# EAGLE schematic Converter Board (EAGLE 8.3.1)
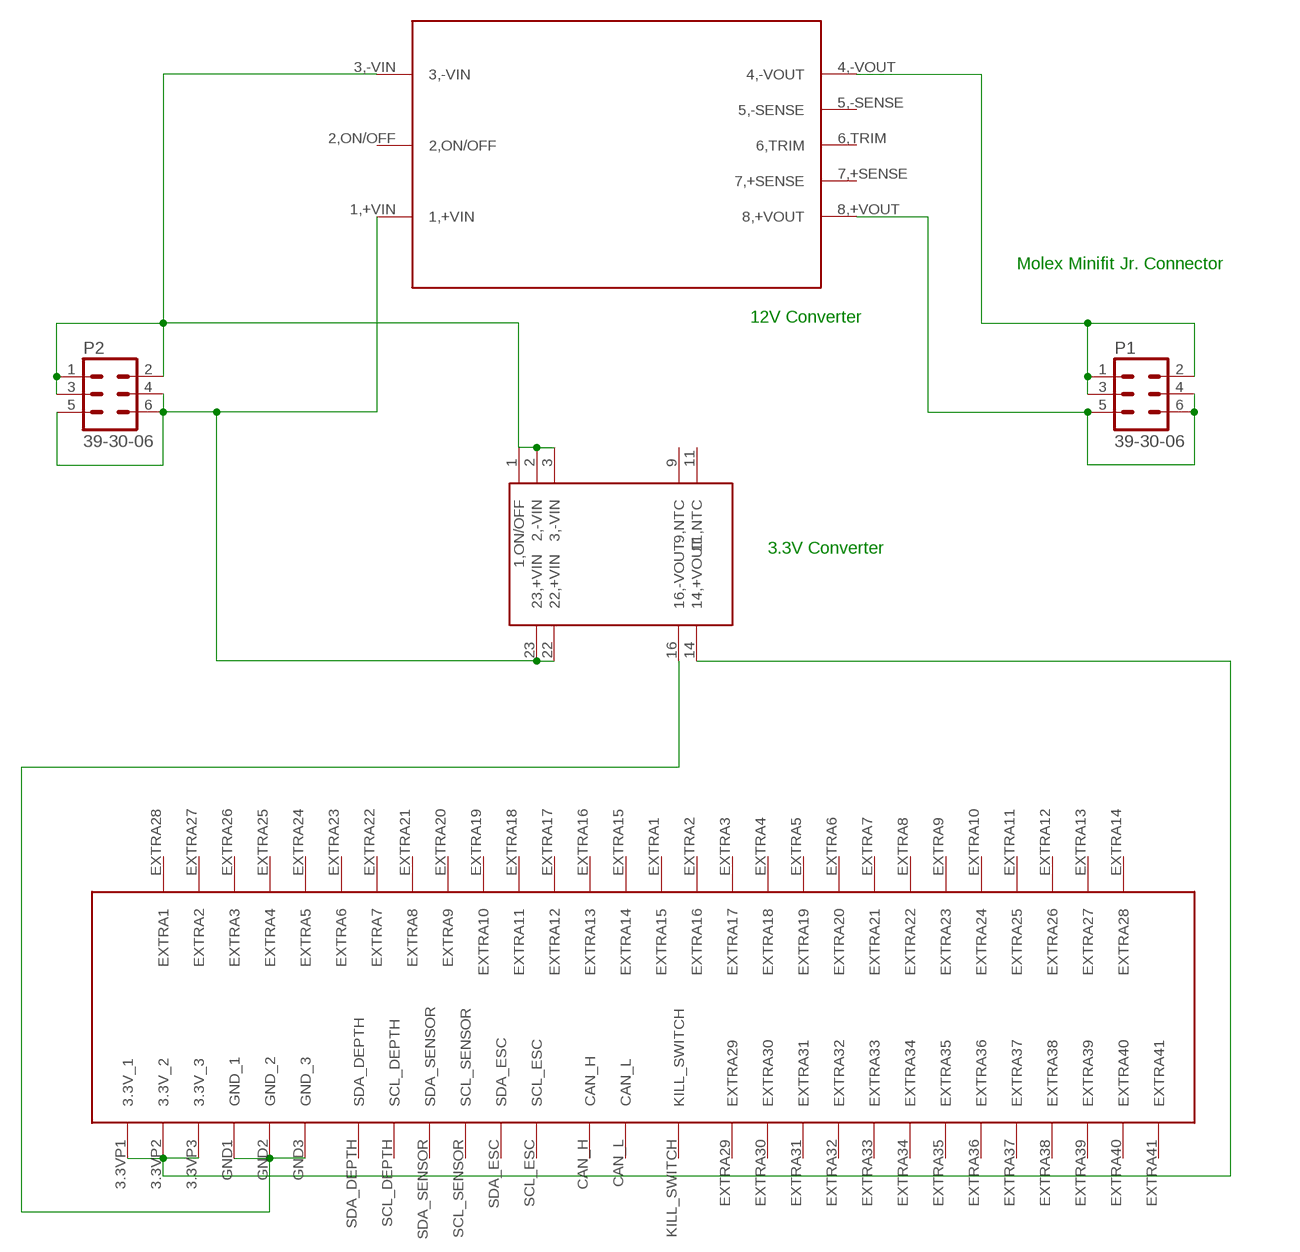
[diagram p0: schematic, sheet 1]

## Parts
P1  39-30-06  [39-30-?06?]
P2  39-30-06  [39-30-?06?]
U$1  3.3VCONV  [3.3VCONV]
U$2  12VCONV  [12VCONV]
U$3  5530843  [5530843-6-BOARDFINGERS]

## Nets
N$1: P2.4 P2.5 P2.6 U$1.22(22,+VIN) U$1.23(23,+VIN) U$2.1,+VIN
N$4: P2.1 P2.2 P2.3 U$1.2(2,-VIN) U$1.3(3,-VIN) U$2.3,-VIN
N$5: U$1.14(14,+VOUT) U$3.3.3VP1(3.3V_1) U$3.3.3VP2(3.3V_2) U$3.3.3VP3(3.3V_3)
N$6: U$1.16(16,-VOUT) U$3.GND1(GND_1) U$3.GND2(GND_2) U$3.GND3(GND_3)
N$10: P1.1 P1.2 P1.3
N$11: P1.4 P1.5 P1.6 U$2.8,+VOUT
Unconnected: U$1.1(1,ON/OFF) U$1.9(9,NTC) U$1.11(11,NTC) U$2.2,ON/OFF U$2.4,-VOUT U$2.5,-SENSE U$2.6,TRIM U$2.7,+SENSE U$3.CAN_H U$3.CAN_L U$3.EXTRA1(EXTRA15) U$3.EXTRA2(EXTRA16) U$3.EXTRA3(EXTRA17) U$3.EXTRA4(EXTRA18) U$3.EXTRA5(EXTRA19) U$3.EXTRA6(EXTRA20) U$3.EXTRA7(EXTRA21) U$3.EXTRA8(EXTRA22) U$3.EXTRA9(EXTRA23) U$3.EXTRA10(EXTRA24) U$3.EXTRA11(EXTRA25) U$3.EXTRA12(EXTRA26) U$3.EXTRA13(EXTRA27) U$3.EXTRA14(EXTRA28) U$3.EXTRA15(EXTRA14) U$3.EXTRA16(EXTRA13) U$3.EXTRA17(EXTRA12) U$3.EXTRA18(EXTRA11) U$3.EXTRA19(EXTRA10) U$3.EXTRA20(EXTRA9) U$3.EXTRA21(EXTRA8) U$3.EXTRA22(EXTRA7) U$3.EXTRA23(EXTRA6) U$3.EXTRA24(EXTRA5) U$3.EXTRA25(EXTRA4) U$3.EXTRA26(EXTRA3) U$3.EXTRA27(EXTRA2) U$3.EXTRA28(EXTRA1) U$3.EXTRA29 U$3.EXTRA30 U$3.EXTRA31 U$3.EXTRA32 U$3.EXTRA33 U$3.EXTRA34 U$3.EXTRA35 U$3.EXTRA36 U$3.EXTRA37 U$3.EXTRA38 U$3.EXTRA39 U$3.EXTRA40 U$3.EXTRA41 U$3.KILL_SWITCH U$3.SCL_DEPTH U$3.SCL_ESC U$3.SCL_SENSOR U$3.SDA_DEPTH U$3.SDA_ESC U$3.SDA_SENSOR

## Notes on the sheet
- Molex Minifit Jr. Connector
- 12V Converter
- 3.3V Converter

## Library data of the parts
P1 P2 = con-molex-mini-fit:39-30-?06?: HEADER
U$1 = 3.3V Converter:3.3VCONV
U$2 = 12VCONV:12VCONV
U$3 = 5530843-6:5530843